# EAGLE design 555_rfm95w_breakout_v2_1 (EAGLE 7.5.0)
RFM95W
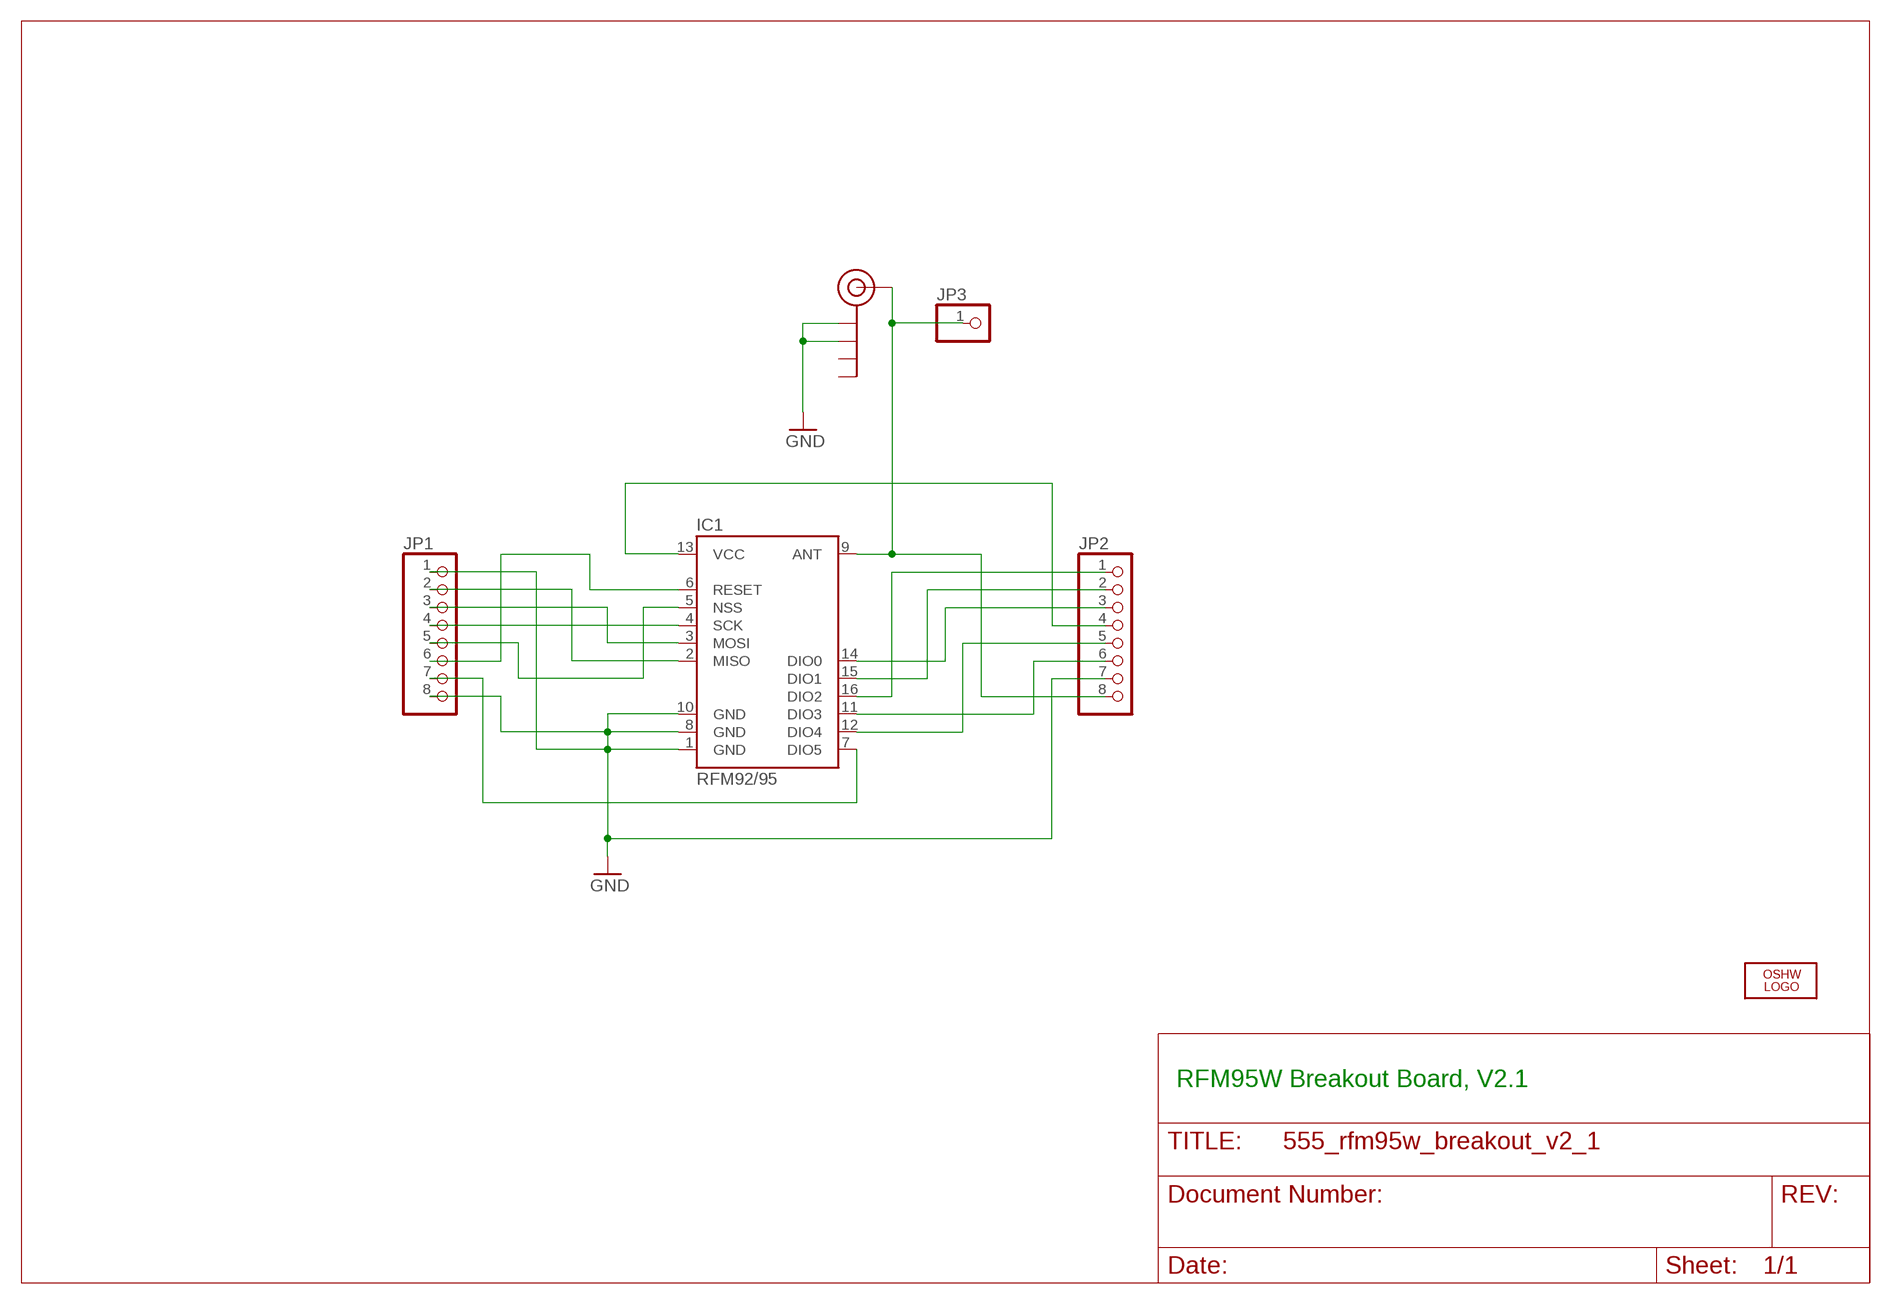
[diagram p0: schematic, sheet 1]

## Parts
IC1  RFM92/95  RFM95WSMD  [RFM95W_SMD]
J$1  ANT  SMA_EDGE  [SMA_EDGE]
JP1  PINHD-1X8  [1X08]
JP2  PINHD-1X8  [1X08]
JP3  PINHD-1X1  [1X01]
LOGO1  OSHW_LOGO_FILLX0100-NT  [OSHW_FILLX100_NOTEXT]

## Nets
GND: IC1.1(GND) IC1.8(GND) IC1.10(GND) J$1.GND@0(GND) J$1.GND@1(GND) JP1.1 JP1.8 JP2.7
N$1: IC1.9(ANT) J$1.SIG(SIGNAL) JP2.8 JP3.1
N$2: IC1.13(VCC) JP2.4
N$6: IC1.2(MISO) JP1.2
N$7: IC1.3(MOSI) JP1.3
N$8: IC1.4(SCK) JP1.4
N$9: IC1.5(NSS) JP1.5
N$10: IC1.6(RESET) JP1.6
N$11: IC1.7(DIO5) JP1.7
N$12: IC1.11(DIO3) JP2.6
N$13: IC1.12(DIO4) JP2.5
N$14: IC1.14(DIO0) JP2.3
N$15: IC1.15(DIO1) JP2.2
N$16: IC1.16(DIO2) JP2.1
Unconnected: J$1.GND@2(GND) J$1.GND@3(GND)

## Notes on the sheet
- RFM95W Breakout Board, V2.1

## Library data of the parts
IC1 = misiek:RFM95W
J$1 = SparkFun-3-2-07:SMA_EDGE: SMA Antenna Connector End launch SMA connector. The paste layer has been removed so that the connector can be hand soldered onto the board after reflow.
JP1 JP2 = pinhead:PINHD-1X8: PIN HEADER
JP3 = pinhead:PINHD-1X1: PIN HEADER
LOGO1 = ohw-logo:OSHW_LOGO_FILL

## Net classes
1 fiftyohm: width 1 mm

## Board
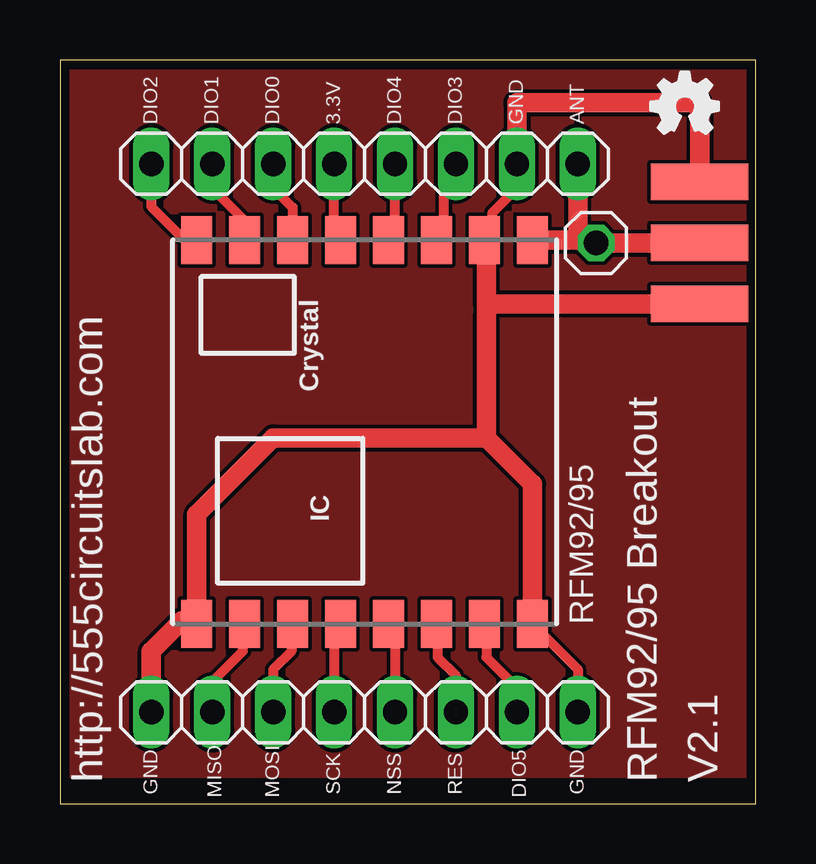
[diagram p1: board, top side]
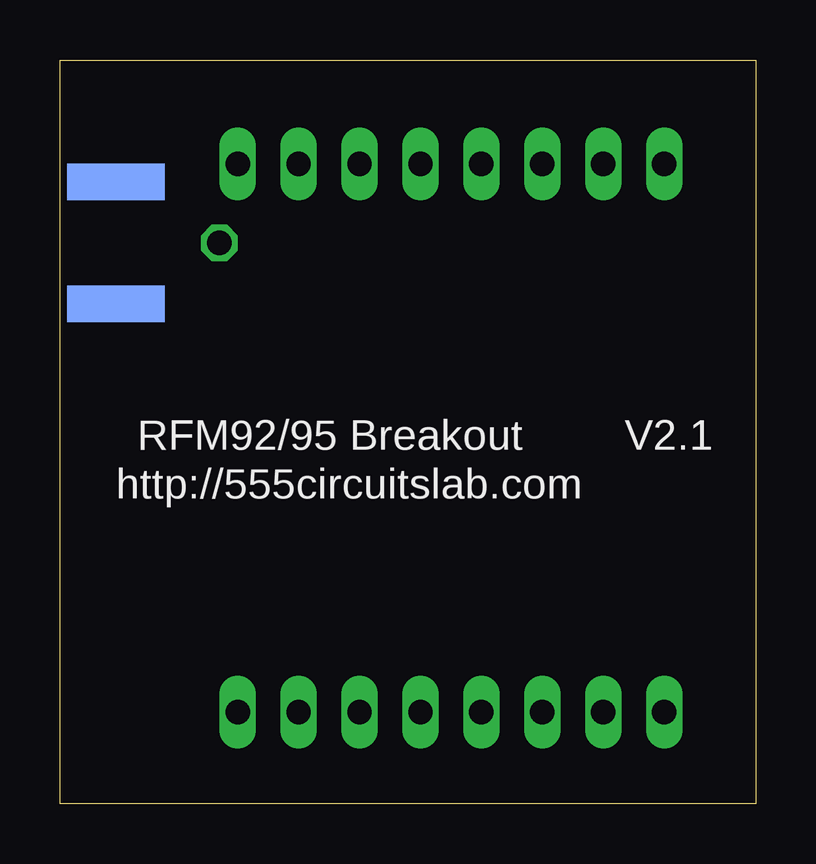
[diagram p2: board, bottom side, seen from below]

Size 29 x 31 mm. Coordinates in mm from the lower left corner, seen from the top.
Outline: 0,0 29,0 29,31 0,31 0,0
Copper layers (1*16): Top 0.0356mm / dielectric 1.5011mm / Bottom 0.0356mm
Design rules "default": minimum track width 6mil, minimum drill 13mil, track to track 6mil, track to pad 6mil, pad to pad 6mil, via to via 6mil, smd to smd 6mil, copper to edge 15mil, drill to drill 6mil, minimum pad ring 7mil, minimum via ring 7mil, stop-mask expansion 4mil, vias tented up to drill 0mil, thermal gap 10mil

### Footprints (pad centres in the part's own frame; a part is rotated, then mirrored left to right if it is on the bottom)
RFM95W_SMD = smd 2 x 1.3: 1 -8,7; 2 -8,5; 3 -8,3; 4 -8,1; 5 -8,-1; 6 -8,-3; 7 -8,-5; 8 -8,-7; 9 8,-7; 10 8,-5; 11 8,-3; 12 8,-1; 13 8,1; 14 8,3; 15 8,5; 16 8,7
SMA_EDGE = smd 1.524 x 4.064: GND@0 0,0; GND@1 5.08,0; SIG 2.54,0 | smd 1.524 x 4.064 bottom: GND@2 0,0; GND@3 5.08,0
1X08 = drill 1.016 long: 1 -8.89,0; 2 -6.35,0; 3 -3.81,0; 4 -1.27,0; 5 1.27,0; 6 3.81,0; 7 6.35,0; 8 8.89,0
1X01 = drill 1.016 octagon: 1 0,0

### Placement (x,y rotation side)
IC1  12.7,15.49 90 top
J$1  26.67,25.91 270 top
JP1  12.7,3.81 0 top
JP2  12.7,26.67 0 top
JP3  22.35,23.37 0 top
LOGO1  24.64,27.94 0 top

### Tracks (layer width: path | path; a pad name or v marks a point on that pad's centre or on a via)
GND
  Top 0.406: IC1.8 21.59,5.6 JP1.8 | IC1.10 18.03,23.83 18.03,24.64 19.05,25.65 JP2.7
  Top 0.813: IC1.10 17.78,23.41 17.78,20.83 | 19.05,27.94 JP2.7 19.05,29.21 26.67,29.21 J$1.GND@0 | IC1.8 19.7,13.32 17.78,15.24 | 17.78,15.24 17.78,20.32 17.78,20.83 | JP1.1 3.81,6.35 5.08,7.62 5.57,7.62 IC1.1 5.7,12.05 8.89,15.24 17.78,15.24 | J$1.GND@1 17.78,20.83
N$1
  Top 0.813: 26.67,23.49 J$1.SIG JP3.1 22.35,23.49 21.59,23.49 | IC1.9 21.59,23.49 | 21.59,23.49 JP2.8
N$2
  Top 0.406: IC1.13 11.43,23.76 JP2.4
N$3
  pour Top: 0,30.48 29.21,30.48 29.21,1.27 0,1.27
N$6
  Top 0.406: IC1.2 7.62,7.41 7.62,6.35 6.35,5.08 JP1.2
N$7
  Top 0.406: IC1.3 9.65,7.45 9.65,6.35 8.89,5.59 JP1.3
N$8
  Top 0.406: IC1.4 11.43,7.22 JP1.4
N$9
  Top 0.406: IC1.5 13.97,7.22 JP1.5
N$10
  Top 0.406: IC1.6 15.75,7.45 15.75,6.1 16.51,5.33 JP1.6
N$11
  Top 0.406: IC1.7 17.78,7.41 17.78,6.1 19.05,4.83 JP1.7
N$12
  Top 0.406: IC1.11 16,23.8 16,25.91 16.51,26.42 JP2.6
N$13
  Top 0.406: IC1.12 13.97,23.76 JP2.5
N$14
  Top 0.406: JP2.3 8.89,25.65 9.7,24.84 IC1.14
N$15
  Top 0.406: JP2.2 6.35,25.65 7.7,24.3 IC1.15
N$16
  Top 0.406: JP2.1 3.81,24.89 5.21,23.49 IC1.16

### Text on the board
tNames: DIO2 | DIO1 | DIO0 | 3.3V | DIO4 | DIO3 | GND | ANT | http://555circuitslab.com | RFM92/95 Breakout | V2.1 | GND | MISO | MOSI | SCK | NSS | RES | DIO5 | GND
bNames: V2.1 | RFM92/95 Breakout | http://555circuitslab.com